# Altium schematic sheet sensor de corriente.SchDoc
size A3; PageSetup: Record=PageOptions|CenterHorizontal=True|CenterVertical=True|PrintScale=0.70|XCorrection=1.00|YCorrection=1.00|PrintKind=1|BorderSize=5000000|LeftOffset=0|BottomOffset=0|Orientation=2|PaperLength=1000|PaperWidth=1000|Scale=100|PaperSource=1|PrintQuality=300|MediaType=1|DitherType=10|PaperKind=A4|PrintScaleMode=1
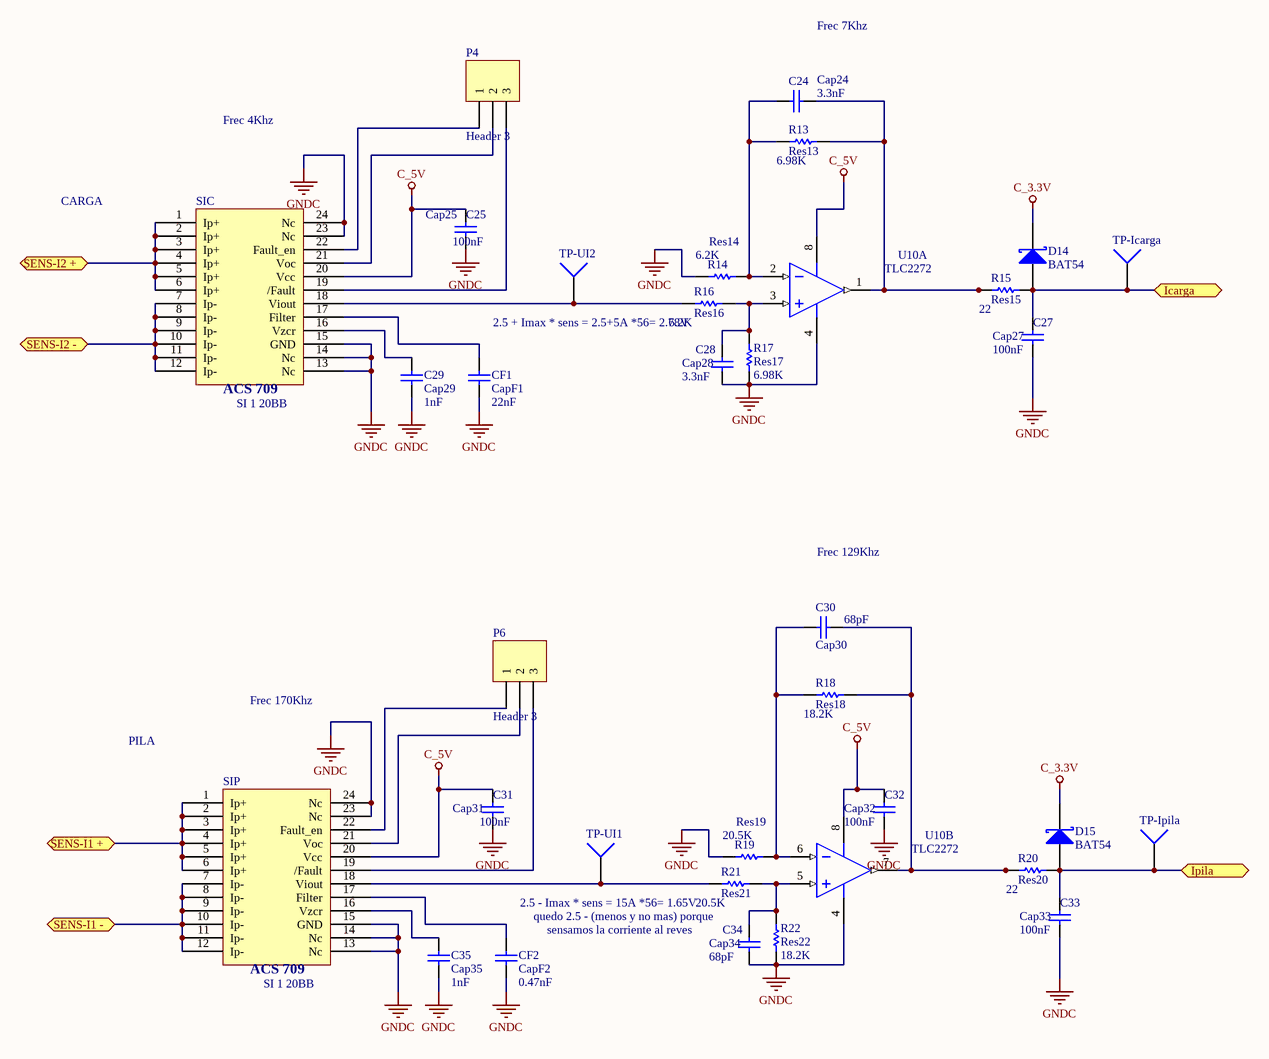
[diagram p0: sensor de corriente.SchDoc]

## Parts
C24  Cap24  value 3.3nF  [RAD-0.1]
C25  Cap25  value 100nF  [8-1206]
C27  Cap27  value 100nF  [8-1206]
C28  Cap28  value 3.3nF  [RAD-0.1]
C29  Cap29  value 1nF  [8-1206]
C30  Cap30  value 68pF  [RAD-0.1]
C31  Cap31  value 100nF  [8-1206]
C32  Cap32  value 100nF  [8-1206]
C33  Cap33  value 100nF  [8-1206]
C34  Cap34  value 68pF  [RAD-0.1]
C35  Cap35  value 1nF  [8-1206]
CF1  CapF1  value 22nF  [RAD-0.1]
CF2  CapF2  value 0.47nF  [8-1206]
D14  BAT54  [SOD123*]
D15  BAT54  [SOD123*]
P4  Header 3  [HDR1X3*]
P6  Header 3  [HDR1X3*]
R13  Res13  value 6.98K  [AXIAL-0.4]
R14  Res14  value 6.2K  [AXIAL-0.4]
R15  Res15  value 22  [8-1206]
R16  Res16  value 6.2K  [AXIAL-0.4]
R17  Res17  value 6.98K  [AXIAL-0.4]
R18  Res18  value 18.2K  [AXIAL-0.4]
R19  Res19  value 20.5K  [AXIAL-0.4]
R20  Res20  value 22  [8-1206]
R21  Res21  value 20.5K  [AXIAL-0.4]
R22  Res22  value 18.2K  [AXIAL-0.4]
SIC  SI 1 20BB  [Sensor Corriente ACS 709]
SIP  SI 1 20BB  [Sensor Corriente ACS 709]
TP-Icarga  (no value)  [PIN1]
TP-Ipila  (no value)  [PIN1]
TP-UI1  (no value)  [PIN1]
TP-UI2  (no value)  [PIN1]
U10  TLC2272  [751-02_N]  (parts A,B of 2)

## Ports
Icarga, Ipila, SENS-I1 + (bidir), SENS-I1 - (bidir), SENS-I2 + (bidir), SENS-I2 - (bidir)

## Nets
C_3.3V: D14.2(K) D15.2(K)
C_5V: C25.1 C31.1 C32.1 SIC.20(Vcc) SIP.20(Vcc) U10.8(VDD)
GNDC: C25.2 C27.2 C28.2 C29.2 C31.2 C32.2 C33.2 C34.2 C35.2 CF1.1 CF2.1 R14.1 R17.2 R19.1 R22.2 SIC.13(Nc) SIC.14(Nc) SIC.15(GND) SIC.23(Nc) SIC.24(Nc) SIP.13(Nc) SIP.14(Nc) SIP.15(GND) SIP.23(Nc) SIP.24(Nc) U10.4(GND)
Icarga: C27.1 D14.1(A) R15.2 TP-Icarga.1 ; port Icarga
Ipila: C33.1 D15.1(A) R20.2 TP-Ipila.1 ; port Ipila
SENS-I1 +: SIP.1(Ip+) SIP.2(Ip+) SIP.3(Ip+) SIP.4(Ip+) SIP.5(Ip+) SIP.6(Ip+) ; port SENS-I1 +
SENS-I1 -: SIP.7(Ip-) SIP.8(Ip-) SIP.9(Ip-) SIP.10(Ip-) SIP.11(Ip-) SIP.12(Ip-) ; port SENS-I1 -
SENS-I2 +: SIC.1(Ip+) SIC.2(Ip+) SIC.3(Ip+) SIC.4(Ip+) SIC.5(Ip+) SIC.6(Ip+) ; port SENS-I2 +
SENS-I2 -: SIC.7(Ip-) SIC.8(Ip-) SIC.9(Ip-) SIC.10(Ip-) SIC.11(Ip-) SIC.12(Ip-) ; port SENS-I2 -
NetC24_1: C24.1 R13.1 R14.2 U10.2(IN-)
NetC24_2: C24.2 R13.2 R15.1 U10.1(OUT)
NetC28_1: C28.1 R16.2 R17.1 U10.3(IN+)
NetC29_1: C29.1 SIC.16(Vzcr)
NetC30_1: C30.1 R18.1 R19.2 U10.6(IN-)
NetC30_2: C30.2 R18.2 R20.1 U10.7(OUT)
NetC34_1: C34.1 R21.2 R22.1 U10.5(IN+)
NetC35_1: C35.1 SIP.16(Vzcr)
NetCF1_2: CF1.2 SIC.17(Filter)
NetCF2_2: CF2.2 SIP.17(Filter)
NetP4_1: P4.1 SIC.22(Fault_en)
NetP4_2: P4.2 SIC.21(Voc)
NetP4_3: P4.3 SIC.19(/Fault)
NetP6_1: P6.1 SIP.22(Fault_en)
NetP6_2: P6.2 SIP.21(Voc)
NetP6_3: P6.3 SIP.19(/Fault)
NetR16_1: R16.1 SIC.18(Viout) TP-UI2.1
NetR21_1: R21.1 SIP.18(Viout) TP-UI1.1

## Notes on the sheet
- Frec 7Khz
- Frec 4Khz
- CARGA
- (near R16) 2.5 + Imax * sens = 2.5+5A *56= 2.78V
- Frec 129Khz
- PILA
- Frec 170Khz
- (near R21) 2.5 - Imax * sens = 15A *56= 1.65V
- quedo 2.5 - (menos y no mas) porque
- (near C34) sensamos la corriente al reves
- (in symbol Component_1) ACS 709

## Library data of the parts
C24 C28 C30 C34 = Cap: THRU MULTICAPA 50V; Published: 8-Jun-2000; LatestRevisionDate: 17-Jul-2002; LatestRevisionNote: Re-released for DXP Platform.; PackageReference: RAD-0.3; Publisher: Altium Limited; PackageDescription: Radial Cap, Thru-Hole; 2 Leads; 0.3 in Pin Spacing
C25 C27 C29 C31-C33 C35 CF1 CF2 = Cap: SMD MULTICAPA 50V; Published: 8-Jun-2000; LatestRevisionDate: 17-Jul-2002; LatestRevisionNote: Re-released for DXP Platform.; PackageReference: RAD-0.3; Publisher: Altium Limited; PackageDescription: Radial Cap, Thru-Hole; 2 Leads; 0.3 in Pin Spacing
D14 = BAT54: SMD; Note: Pin 2 is not connected and is not drawn; Published: 17-Sep-2003; LatestRevisionDate: 12-Dec-2006; LatestRevisionNote: IPC-7351 Footprint Added.; DatasheetVersion: 4-Mar-2002; PackageVersion: May-1999; PackageReference: SOT23; Publisher: Altium Limited; PackageDescription: 3-Pin SOT-23 Package 0.95 mm Pitch, 2.3 mm Lead Span; ComponentLink1Description: Manufacturer Link; ComponentLink1URL: http://www.semiconductors.philips.com/; ComponentLink2Description: Datasheet; ComponentLink2URL: http://www.semiconductors.philips.com/acrobat/datasheets/BAT54_SERIES_4.pdf
D15 = BAT54: Schottky Barrier Diode SMD; Note: Pin 2 is not connected and is not drawn; Published: 17-Sep-2003; LatestRevisionDate: 12-Dec-2006; LatestRevisionNote: IPC-7351 Footprint Added.; DatasheetVersion: 4-Mar-2002; PackageVersion: May-1999; PackageReference: SOT23; Publisher: Altium Limited; PackageDescription: 3-Pin SOT-23 Package 0.95 mm Pitch, 2.3 mm Lead Span; ComponentLink1Description: Manufacturer Link; ComponentLink1URL: http://www.semiconductors.philips.com/; ComponentLink2Description: Datasheet; ComponentLink2URL: http://www.semiconductors.philips.com/acrobat/datasheets/BAT54_SERIES_4.pdf
P4 P6 = Header 3: Header, 3-Pin; LatestRevisionDate: 17-Jul-2002; LatestRevisionNote: Re-released for DXP Platform.; Publisher: Altium Limited
R13 R14 R16-R19 R21 R22 = Res1: Resistor; Published: 8-Jun-2000; LatestRevisionDate: 17-Jul-2002; LatestRevisionNote: Re-released for DXP Platform.; PackageReference: AXIAL-0.3; Publisher: Altium Limited; PackageDescription: Axial Device, Thru-Hole; 2 Leads; 0.3 in Pin Spacing
R15 R20 = Res1: SMD 1206; Published: 8-Jun-2000; LatestRevisionDate: 17-Jul-2002; LatestRevisionNote: Re-released for DXP Platform.; PackageReference: AXIAL-0.3; Publisher: Altium Limited; PackageDescription: Axial Device, Thru-Hole; 2 Leads; 0.3 in Pin Spacing
SIC SIP = Component_1
TP-Icarga TP-Ipila TP-UI1 TP-UI2 = Socket: LatestRevisionDate: 17-Jul-2002; LatestRevisionNote: Re-released for DXP Platform.; Publisher: Altium Limited
U10 = TLC27L2ACDR: LinCMOS Precision Dual Operational Amplifier; Published: 15-Apr-2002; LatestRevisionDate: 13-Apr-2006; LatestRevisionNote: IPC-7351 Footprint Added.; DatasheetVersion: Aug-1988; PackageVersion: Jan-1998; PackageReference: D008; Publisher: Altium Limited; PackageDescription: 8-Pin Small Outline Integrated Circuit 1.27 mm Pitch; Code_IPC: SOIC127P600-8; ComponentLink1Description: Manufacturer Link; ComponentLink1URL: http://www.ti.com/; ComponentLink2Description: Datasheet; ComponentLink2URL: http://www-s.ti.com/sc/ds/tlc27l2a.pdf